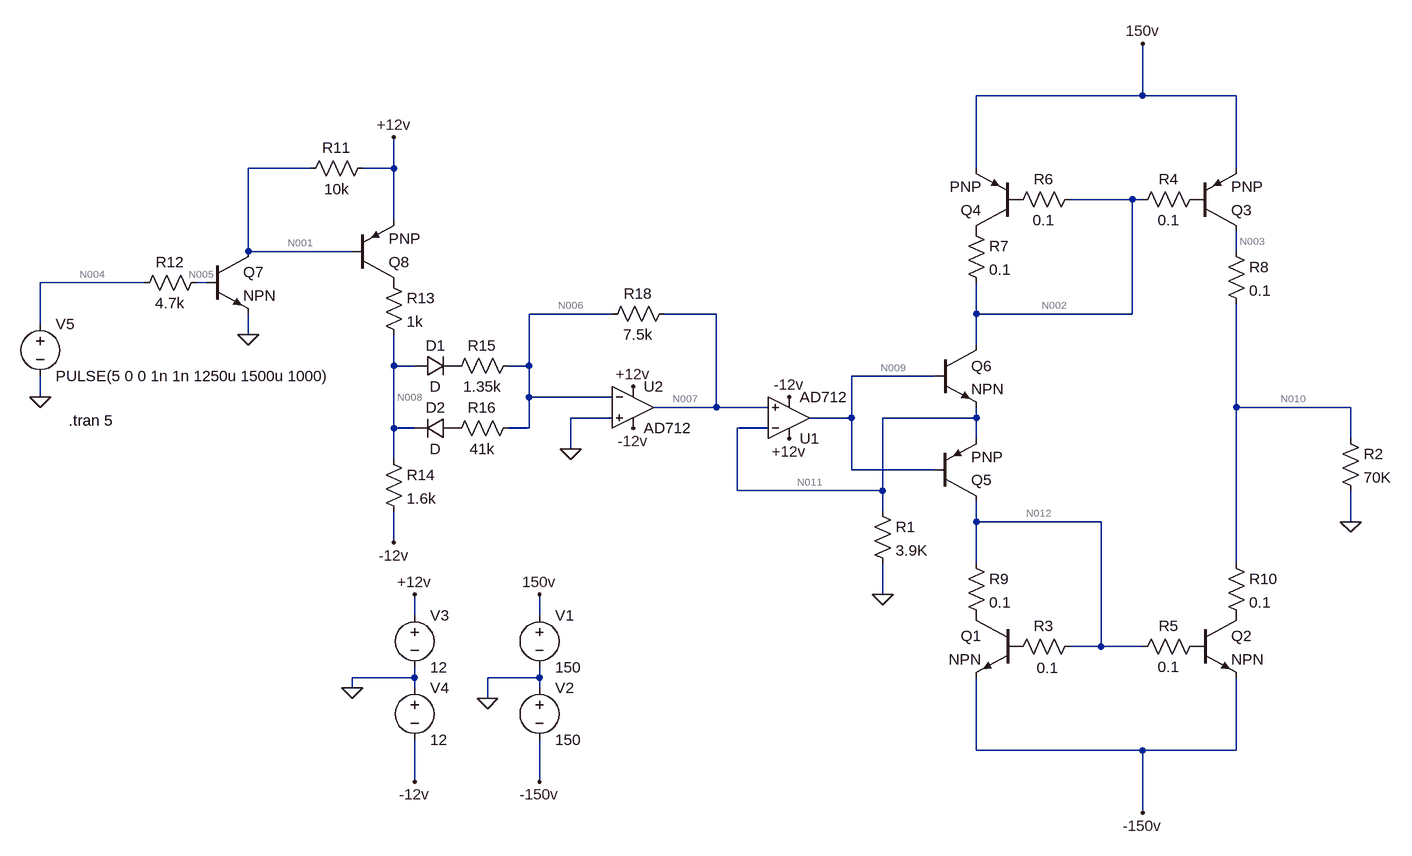
[diagram p0: schematic Fuente de Corrientes.asc]
Fuente de Corrientes.asc, the LTspice schematic file:
Version 4
SHEET 1 1160 976
WIRE 48 -400 48 -480
WIRE 48 -400 -208 -400
WIRE 192 -400 48 -400
WIRE -1232 -288 -1328 -288
WIRE -1104 -288 -1104 -336
WIRE -1104 -288 -1152 -288
WIRE -208 -288 -208 -400
WIRE 192 -288 192 -400
WIRE 32 -240 -64 -240
WIRE 48 -240 32 -240
WIRE -1104 -208 -1104 -288
WIRE -1328 -160 -1328 -288
WIRE -1168 -160 -1328 -160
WIRE 192 -160 192 -192
WIRE -1488 -112 -1648 -112
WIRE -1392 -112 -1408 -112
WIRE -768 -64 -896 -64
WIRE -608 -64 -688 -64
WIRE -208 -64 -208 -112
WIRE 32 -64 32 -240
WIRE 32 -64 -208 -64
WIRE -1648 -48 -1648 -112
WIRE -1328 -32 -1328 -64
WIRE -208 -16 -208 -64
WIRE -1104 16 -1104 -32
WIRE -1072 16 -1104 16
WIRE -896 16 -896 -64
WIRE -896 16 -928 16
WIRE -272 32 -400 32
WIRE -1648 64 -1648 32
WIRE -896 64 -896 16
WIRE -768 64 -896 64
WIRE -608 80 -608 -64
WIRE -608 80 -704 80
WIRE -528 80 -608 80
WIRE 192 80 192 -80
WIRE 368 80 192 80
WIRE -768 96 -832 96
WIRE -400 96 -400 32
WIRE -400 96 -464 96
WIRE -208 96 -208 80
WIRE -208 96 -352 96
WIRE -1104 112 -1104 16
WIRE -1072 112 -1104 112
WIRE -896 112 -896 64
WIRE -896 112 -928 112
WIRE -528 112 -576 112
WIRE -208 128 -208 96
WIRE 368 128 368 80
WIRE -832 144 -832 96
WIRE -1104 160 -1104 112
WIRE -400 176 -400 96
WIRE -272 176 -400 176
WIRE -576 208 -576 112
WIRE -352 208 -352 96
WIRE -352 208 -576 208
WIRE -352 240 -352 208
WIRE -208 256 -208 224
WIRE -16 256 -208 256
WIRE 368 256 368 208
WIRE -1104 288 -1104 240
WIRE -208 320 -208 256
WIRE 192 320 192 80
WIRE -352 368 -352 320
WIRE -1072 400 -1072 368
WIRE -880 400 -880 368
WIRE -16 448 -16 256
WIRE -16 448 -64 448
WIRE 48 448 -16 448
WIRE -1072 496 -1072 480
WIRE -1072 496 -1168 496
WIRE -880 496 -880 480
WIRE -880 496 -960 496
WIRE -1168 512 -1168 496
WIRE -1072 512 -1072 496
WIRE -880 512 -880 496
WIRE -960 528 -960 496
WIRE -208 608 -208 496
WIRE 48 608 -208 608
WIRE 192 608 192 496
WIRE 192 608 48 608
WIRE -1072 656 -1072 592
WIRE -880 656 -880 592
WIRE 48 704 48 608
FLAG -352 368 0
FLAG 48 -480 150v
FLAG 48 704 -150v
FLAG 368 256 0
FLAG -1168 512 0
FLAG -960 528 0
FLAG -880 368 150v
FLAG -880 656 -150v
FLAG -1072 368 +12v
FLAG -1072 656 -12v
FLAG -1648 64 0
FLAG -1328 -32 0
FLAG -1104 288 -12v
FLAG -1104 -336 +12v
FLAG -832 144 0
FLAG -736 48 +12v
FLAG -736 112 -12v
FLAG -496 64 -12v
FLAG -496 128 +12v
SYMBOL npn -144 400 M0
SYMATTR InstName Q1
SYMBOL npn 128 400 R0
SYMATTR InstName Q2
SYMBOL pnp 128 -192 M180
SYMATTR InstName Q3
SYMBOL pnp -144 -192 R180
SYMATTR InstName Q4
SYMBOL pnp -272 224 M180
SYMATTR InstName Q5
SYMBOL npn -272 -16 R0
SYMATTR InstName Q6
SYMBOL res -368 224 R0
SYMATTR InstName R1
SYMATTR Value 3.9K
SYMATTR SpiceLine tol=1 pwr=0.1
SYMBOL res 352 112 R0
SYMATTR InstName R2
SYMATTR Value 70K
SYMATTR SpiceLine tol=1 pwr=0.1
SYMBOL voltage -880 384 R0
WINDOW 123 0 0 Left 0
WINDOW 39 0 0 Left 0
SYMATTR InstName V1
SYMATTR Value 150
SYMBOL voltage -880 496 R0
WINDOW 123 0 0 Left 0
WINDOW 39 0 0 Left 0
SYMATTR InstName V2
SYMATTR Value 150
SYMBOL voltage -1072 384 R0
WINDOW 123 0 0 Left 0
WINDOW 39 0 0 Left 0
SYMATTR InstName V3
SYMATTR Value 12
SYMBOL voltage -1072 496 R0
WINDOW 123 0 0 Left 0
WINDOW 39 0 0 Left 0
SYMATTR InstName V4
SYMATTR Value 12
SYMBOL voltage -1648 -64 R0
WINDOW 123 0 0 Left 0
WINDOW 39 0 0 Left 0
SYMATTR InstName V5
SYMATTR Value PULSE(5 0 0 1n 1n 1250u 1500u 1000)
SYMBOL res 144 -256 R90
WINDOW 0 0 56 VBottom 2
WINDOW 3 32 56 VTop 2
SYMATTR InstName R4
SYMATTR Value 0.1
SYMBOL res -48 432 R90
WINDOW 0 0 56 VBottom 2
WINDOW 3 33 50 VTop 2
SYMATTR InstName R3
SYMATTR Value 0.1
SYMBOL res 144 432 R90
WINDOW 0 0 56 VBottom 2
WINDOW 3 32 56 VTop 2
SYMATTR InstName R5
SYMATTR Value 0.1
SYMBOL res -48 -256 R90
WINDOW 0 0 56 VBottom 2
WINDOW 3 32 56 VTop 2
SYMATTR InstName R6
SYMATTR Value 0.1
SYMBOL res -224 -208 R0
SYMATTR InstName R7
SYMATTR Value 0.1
SYMBOL res 176 -176 R0
SYMATTR InstName R8
SYMATTR Value 0.1
SYMBOL res -224 304 R0
SYMATTR InstName R9
SYMATTR Value 0.1
SYMBOL res 176 304 R0
SYMATTR InstName R10
SYMATTR Value 0.1
SYMBOL npn -1392 -160 R0
SYMATTR InstName Q7
SYMBOL pnp -1168 -112 M180
SYMATTR InstName Q8
SYMBOL OpAmps\\AD712 -736 16 R0
SYMATTR InstName U2
SYMBOL res -1136 -304 R90
WINDOW 0 0 56 VBottom 2
WINDOW 3 32 56 VTop 2
SYMATTR InstName R11
SYMATTR Value 10k
SYMBOL res -1392 -128 R90
WINDOW 0 0 56 VBottom 2
WINDOW 3 32 56 VTop 2
SYMATTR InstName R12
SYMATTR Value 4.7k
SYMBOL res -1120 -128 R0
SYMATTR InstName R13
SYMATTR Value 1k
SYMBOL res -1120 144 R0
SYMATTR InstName R14
SYMATTR Value 1.6k
SYMBOL diode -1072 32 R270
WINDOW 0 32 32 VTop 2
WINDOW 3 0 32 VBottom 2
SYMATTR InstName D1
SYMBOL diode -1008 96 R90
WINDOW 0 0 32 VBottom 2
WINDOW 3 32 32 VTop 2
SYMATTR InstName D2
SYMBOL res -912 0 R90
WINDOW 0 0 56 VBottom 2
WINDOW 3 32 56 VTop 2
SYMATTR InstName R15
SYMATTR Value 1.35k
SYMBOL res -912 96 R90
WINDOW 0 0 56 VBottom 2
WINDOW 3 32 56 VTop 2
SYMATTR InstName R16
SYMATTR Value 41k
SYMBOL res -672 -80 R90
WINDOW 0 0 56 VBottom 2
WINDOW 3 32 56 VTop 2
SYMATTR InstName R18
SYMATTR Value 7.5k
SYMBOL OpAmps\\AD712 -496 160 M180
SYMATTR InstName U1
TEXT -1604 100 Left 2 !.tran 5

The netlist it stands for:
* Fuente de Corrientes.asc
Q1 P001 P002 -150v 0 NPN
Q2 P003 P004 -150v 0 NPN
Q3 N003 P005 150v 0 PNP
Q4 P006 P007 150v 0 PNP
Q5 N012 N009 N011 0 PNP
Q6 N002 N009 N011 0 NPN
R1 N011 0 3.9K tol=1 pwr=0.1
R2 N010 0 70K tol=1 pwr=0.1
V1 150v 0 150
V2 0 -150v 150
V3 +12v 0 12
V4 0 -12v 12
V5 N004 0 PULSE(5 0 0 1n 1n 1250u 1500u 1000)
R4 P005 N002 0.1
R3 N012 P002 0.1
R5 P004 N012 0.1
R6 N002 P007 0.1
R7 P006 N002 0.1
R8 N003 N010 0.1
R9 N012 P001 0.1
R10 N010 P003 0.1
Q7 N001 N005 0 0 NPN
Q8 P008 N001 +12v 0 PNP
XU2 0 N006 +12v -12v N007 AD712  ; pins In+ In- V+ V- OUT
R11 +12v N001 10k
R12 N005 N004 4.7k
R13 P008 N008 1k
R14 N008 -12v 1.6k
D1 N008 P009 D
D2 P010 N008 D
R15 N006 P009 1.35k
R16 N006 P010 41k
R18 N007 N006 7.5k
XU1 N007 N011 +12v -12v N009 AD712  ; pins In+ In- V+ V- OUT
.model D D
.lib standard.dio
.model NPN NPN
.model PNP PNP
.lib standard.bjt
.tran 5
.backanno
.end

* Results of the author's LTspice run, read from the files saved beside the schematic
* Operating Point, zero values left out:
*   V(p001) = -149.2 V
*   V(p002) = -149.2 V
*   V(-150v) = -150 V
*   V(p003) = -139.6 V
*   V(p004) = -149.2 V
*   V(n003) = -139.6 V
*   V(p005) = 149.6 V
*   V(150v) = 150 V
*   V(p006) = 149.6 V
*   V(p007) = 149.6 V
*   V(n012) = -149.2 V
*   V(n009) = -8.808 V
*   V(n011) = -8.015 V
*   V(n002) = 149.6 V
*   V(n010) = -139.6 V
*   V(+12v) = 12 V
*   V(-12v) = -12 V
*   V(n004) = 5 V
*   V(n001) = 11.09 V
*   V(n005) = 889.9 mV
*   V(p008) = 11.98 V
*   V(n006) = 14.38 µV
*   V(n007) = -8.015 V
*   V(n008) = 2.1 V
*   V(p009) = 1.443 V
*   V(p010) = 14.46 µV
*   Ic(Q8) = -9.881 mA
*   Ib(Q8) = -87.36 mA
*   Ie(Q8) = 97.24 mA
*   Ic(Q5) = -2.035 mA
*   Ib(Q5) = -20.35 µA
*   Ie(Q5) = 2.055 mA
*   Ic(Q4) = -440.2 pA
*   Ib(Q4) = -4.798 pA
*   Ie(Q4) = 445 pA
*   Ic(Q3) = -729.5 pA
*   Ib(Q3) = 284.5 pA
*   Ie(Q3) = 445 pA
*   Ic(Q7) = 87.45 mA
*   Ib(Q7) = 874.5 µA
*   Ie(Q7) = -88.32 mA
*   Ic(Q6) = 158.4 pA
*   Ib(Q6) = -159.2 pA
*   Ic(Q2) = 1.995 mA
*   Ib(Q2) = 19.95 µA
*   Ie(Q2) = -2.015 mA
*   Ic(Q1) = 1.995 mA
*   Ib(Q1) = 19.95 µA
*   Ie(Q1) = -2.015 mA
*   I(D2) = -2.11 pA
*   I(D1) = 1.069 mA
*   I(R18) = -1.069 mA
*   I(R16) = -2.11 pA
*   I(R15) = -1.069 mA
*   I(R14) = 8.812 mA
*   I(R13) = 9.881 mA
*   I(R12) = -874.5 µA
*   I(R11) = 90.87 µA
*   I(R10) = 1.995 mA
*   I(R9) = 1.995 mA
*   I(R8) = 727.3 pA
*   I(R7) = 438.3 pA
*   I(R6) = -5.116 pA
*   I(R5) = -19.95 µA
*   I(R3) = 19.95 µA
*   I(R4) = -284.5 pA
*   I(R2) = -1.995 mA
*   I(R1) = -2.055 mA
*   I(V5) = -874.5 µA
*   I(V4) = -19.34 mA
*   I(V3) = -106.8 mA
*   I(V2) = -4.03 mA
*   I(V1) = -885.8 pA
*   Ix(u2:1) = 25 pA
*   Ix(u2:2) = 25 pA
*   Ix(u2:3) = 4.619 mA
*   Ix(u2:4) = -5.688 mA
*   Ix(u2:5) = 1.069 mA
*   Ix(u1:1) = 3.626 pA
*   Ix(u1:2) = 3.626 pA
*   Ix(u1:3) = 4.82 mA
*   Ix(u1:4) = -4.84 mA
*   Ix(u1:5) = 20.35 µA